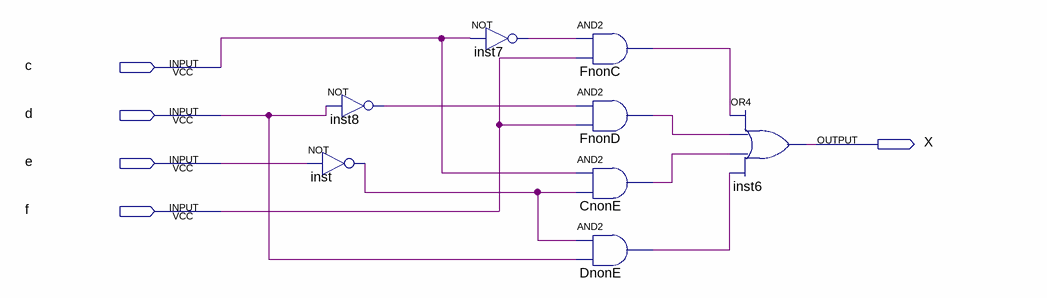
[diagram p0: schematic sheet]
// Quartus schematic JAKUJa0b0.bdf as structural Verilog: 8 symbols, 5 pins
module JAKUJa0b0 (
  input  c,
  input  d,
  input  e,
  input  f,
  output X
);

  wire CnonE_out, DnonE_out, FnonC_out, FnonD_out, inst7_out, inst8_out, inst_out;

  not inst (inst_out, e);
  not inst8 (inst8_out, d);
  not inst7 (inst7_out, c);
  and FnonC (FnonC_out, inst7_out, f);
  and FnonD (FnonD_out, inst8_out, f);
  and CnonE (CnonE_out, c, inst_out);
  and DnonE (DnonE_out, inst_out, d);
  or inst6 (X, FnonC_out, FnonD_out, CnonE_out, DnonE_out);
endmodule
